# Altium project STM32_TFTLCD_ESP8266.PrjPcb
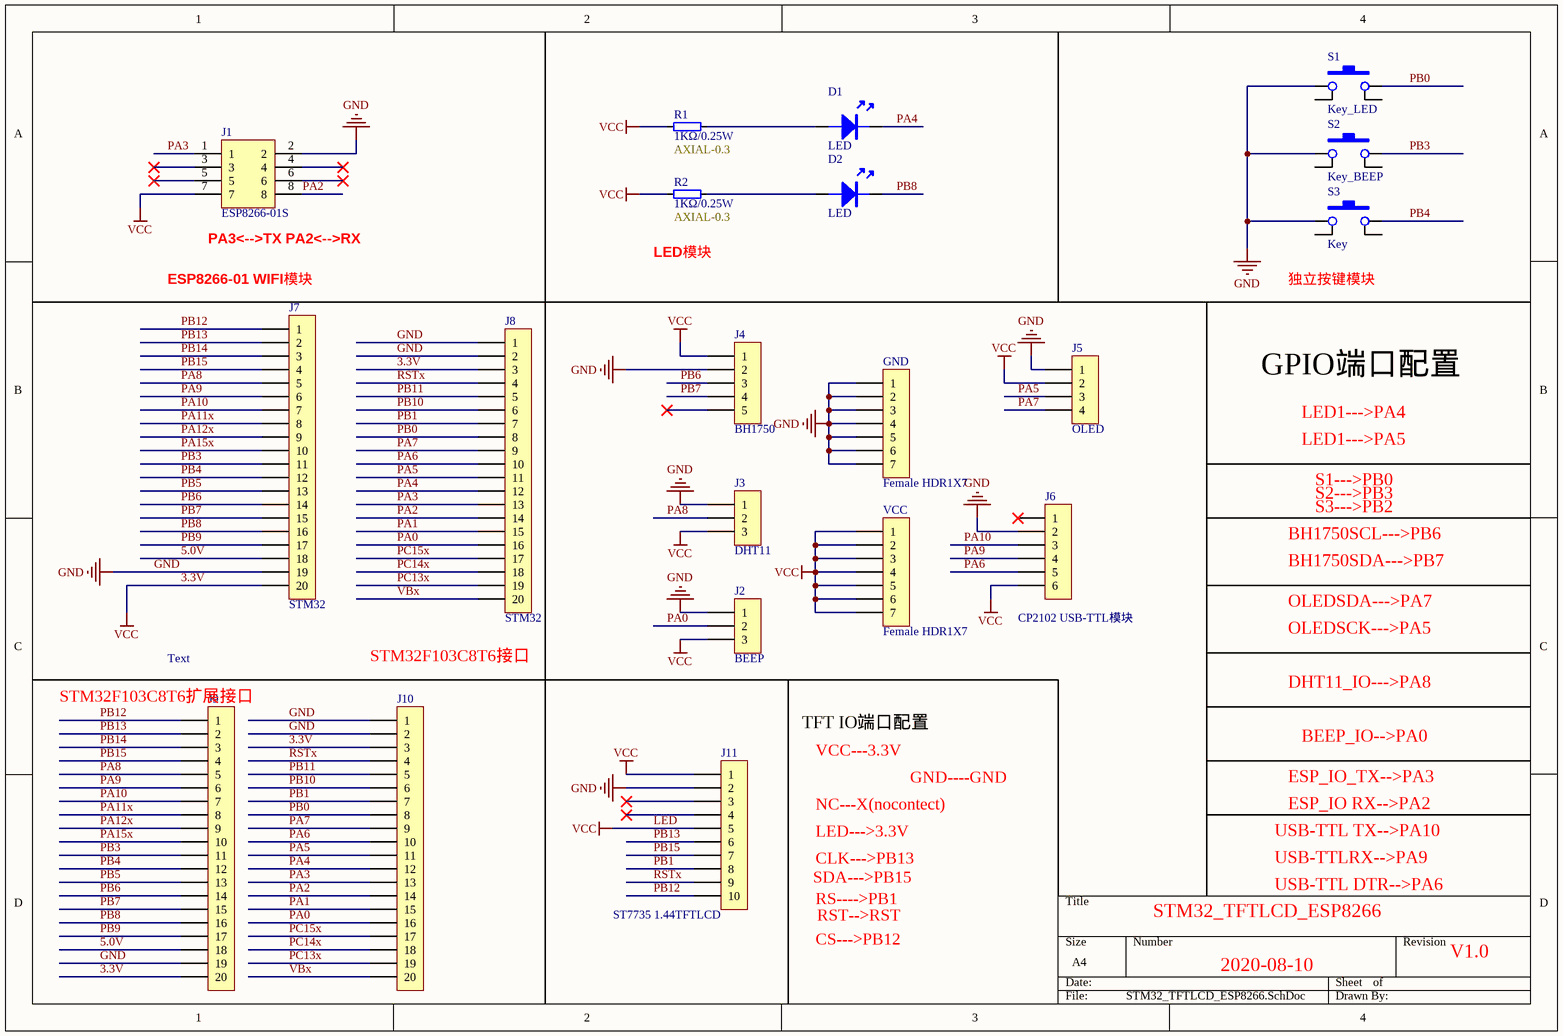
[diagram p0: STM32_TFTLCD_ESP8266.SchDoc]
1 sheet, 20 parts. Net scope: global (net labels, ports and power ports of the same name join across sheets).
Board file: STM32_TFTLCD_ESP8266.PcbDoc

## Sheet STM32_TFTLCD_ESP8266.SchDoc
size A4

### Parts
D1  LED  [LED5-BLUE]
D2  LED  [LED5-BLUE]
GND  Female HDR1X7  [Fe-HDR1X7/2.54-S]
J1  ESP8266-01S  [Fe-HDR2X4/2.54-S]
J2  BEEP  [Fe-HDR1X3/2.54-S]
J3  DHT11  [Fe-HDR1X3/2.54-S]
J4  BH1750  [Fe-HDR1X5/2.54-S]
J5  OLED  [Fe-HDR1X4/2.54-S]
J6  CP2102 USB-TTL模块  [Fe-HDR1X6/2.54-S]
J7  STM32  [Fe-HDR1X20/2.54-S]
J8  STM32  [Fe-HDR1X20/2.54-S]
J9  (no value)  [Pin HDR1X20/2.54mm-S]
J10  (no value)  [Pin HDR1X20/2.54mm-S]
J11  ST7735 1.44TFTLCD  [Fe-HDR1X10/2.54-S]
R1  4.器件属性 - 具体数值: 1KΩ/0.25W  3.器件信息 - 封装类型: AXIAL-0.3  [RES   AXIAL-0.3]  (hidden comment: RES   AXIAL-0.3)
R2  4.器件属性 - 具体数值: 1KΩ/0.25W  3.器件信息 - 封装类型: AXIAL-0.3  [RES   AXIAL-0.3]  (hidden comment: RES   AXIAL-0.3)
S1  3.器件信息 - 名称型号: Key_LED  [BUT/WD - 6.0×6.0/4/VD]  (hidden comment: BUT/WD - 6.0×6.0/4/VD)
S2  3.器件信息 - 名称型号: Key_BEEP  [BUT/WD - 6.0×6.0/4/VD]  (hidden comment: BUT/WD - 6.0×6.0/4/VD)
S3  3.器件信息 - 名称型号: Key  [BUT/WD - 6.0×6.0/4/VD]  (hidden comment: BUT/WD - 6.0×6.0/4/VD)
VCC  Female HDR1X7  [Fe-HDR1X7/2.54-S]

### Nets
3.3V: J1.7 J2.3 J3.3 J4.1 J5.2 J6.6 J7.20 J8.3 J9.20 J10.3 J11.1 J11.5 R1.01 R2.01 VCC.1 VCC.2 VCC.3 VCC.4 VCC.5 VCC.6 VCC.7  [also labelled LED, VCC]
GND: GND.1 GND.2 GND.3 GND.4 GND.5 GND.6 GND.7 J1.2 J2.1 J3.1 J4.2 J5.1 J6.2 J7.19 J8.1 J8.2 J9.19 J10.1 J10.2 J11.2 S1.01A S2.01A S3.01A
5.0V: J7.18 J9.18
PA0: J2.2 J8.16 J10.16
PA1: J8.15 J10.15
PA2: J1.8 J8.14 J10.14
PA3: J1.1 J8.13 J10.13
PA4: D1.K J8.12 J10.12
PA5: J5.3 J8.11 J10.11
PA6: J6.5 J8.10 J10.10
PA7: J5.4 J8.9 J10.9
PA8: J3.2 J7.5 J9.5
PA9: J6.4 J7.6 J9.6
PA10: J6.3 J7.7 J9.7
PA11x: J7.8 J9.8
PA12x: J7.9 J9.9
PA15x: J7.10 J9.10
PB0: J8.8 J10.8 S1.02A
PB1: J8.7 J10.7 J11.8
PB3: J7.11 J9.11 S2.02A
PB4: J7.12 J9.12 S3.02A
PB5: J7.13 J9.13
PB6: J4.3 J7.14 J9.14
PB7: J4.4 J7.15 J9.15
PB8: D2.K J7.16 J9.16
PB9: J7.17 J9.17
PB10: J8.6 J10.6
PB11: J8.5 J10.5
PB12: J7.1 J9.1 J11.10
PB13: J7.2 J9.2 J11.6
PB14: J7.3 J9.3
PB15: J7.4 J9.4 J11.7
PC13x: J8.19 J10.19
PC14x: J8.18 J10.18
PC15x: J8.17 J10.17
RSTx: J8.4 J10.4 J11.9
VBx: J8.20 J10.20
NetD1_A: D1.A R1.02
NetD2_A: D2.A R2.02

Not connected (* = marked no-connect by the designer): J1 3* 4* 5* 6*; J4 5*; J6 1*; J11 3* 4*; S1 01B 02B; S2 01B 02B; S3 01B 02B

### Notes on the sheet
- (near J1) PA3<-->TX PA2<-->RX
- (near J7) ESP8266-01 WIFI模块
- (near R2) LED模块
- (near S3) 独立按键模块
- GPIO端口配置
- LED1--->PA4
- LED1--->PA5
- S1--->PB0
- S2--->PB3
- S3--->PB2
- BH1750SCL--->PB6
- BH1750SDA--->PB7
- OLEDSDA--->PA7
- OLEDSCK--->PA5
- (near J9) STM32F103C8T6扩展接口
- Text
- STM32F103C8T6接口
- DHT11_IO--->PA8
- TFT IO端口配置
- VCC---3.3V
- GND----GND
- ESP_IO_TX-->PA3
- BEEP_IO-->PA0
- NC---X(nocontect)
- LED--->3.3V
- USB-TTL TX-->PA10
- ESP_IO RX-->PA2
- SDA--->PB15
- CLK--->PB13
- RS---->PB1
- RST-->RST
- STM32_TFTLCD_ESP8266
- USB-TTLRX-->PA9
- USB-TTL DTR-->PA6
- CS--->PB12
- 2020-08-10
- V1.0

### Library data of the parts
J1 = Female HDR2X4
J2 J3 = Female HDR1X3
J4 = Female HDR1X5
J5 = Female HDR1X4
J6 = Female HDR1X6
J7 J8 = Female HDR1X20
J9 J10 = Pin HDR1X20
J11 = Female HDR1X10
R1 R2 = RES   AXIAL-0.3: 电阻，色环电阻，AXIAL-0.3封装，; 1.企业名称 - 英文名称: DaXiaoLinSheng / DXLinSheng; 1.企业名称 - 中文名称: 大小林生; 3.器件信息 - 归类信息: 色环电阻; 4.器件属性 - 引脚信息: 2 Pins / 直插; 2.企业链接 - 淘宝商城: https://daxiaolinsheng.taobao.com/; 2.企业链接 - 官方网站: https://www.daxiaolinsheng.com/
S1-S3 = BUT/WD - 6.0×6.0/4/VD: 按键，微动按键，6.0×6.0尺寸，4脚，立式直插; 1.企业名称 - 英文名称: DaXiaoLinSheng / DXLinSheng; 1.企业名称 - 中文名称: 大小林生; 3.器件信息 - 归类信息: 微动按键; 4.器件属性 - 引脚信息: 4 Pins / 直插; 2.企业链接 - 淘宝商城: https://daxiaolinsheng.taobao.com/; 2.企业链接 - 官方网站: https://www.daxiaolinsheng.com/